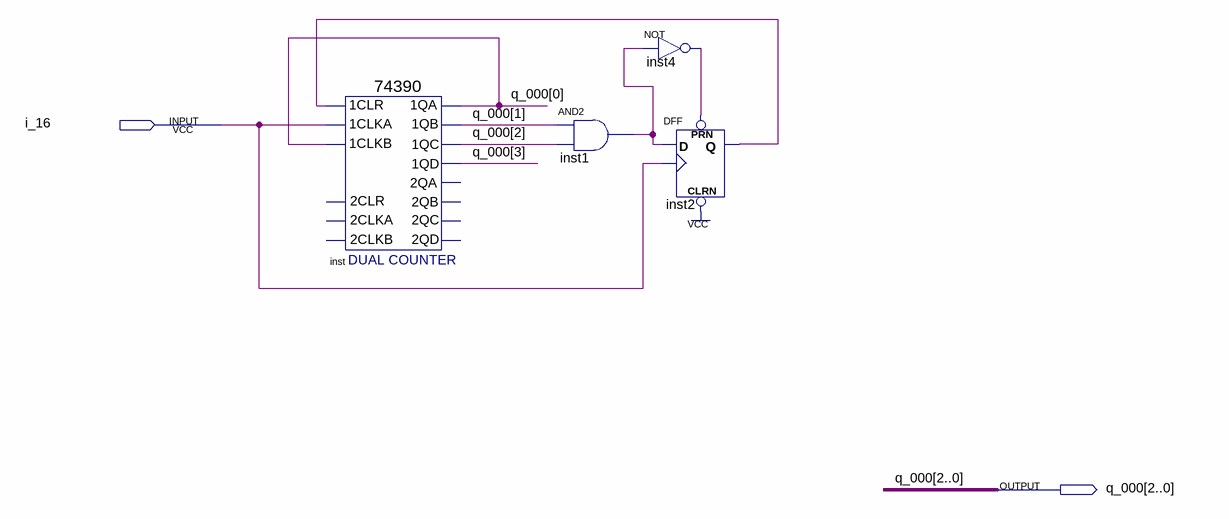
[diagram p0: schematic sheet]
// Quartus schematic cnt6.bdf as structural Verilog: 4 symbols, 2 pins
module cnt6 (
  input  i_16,
  output [3:0] q_000
);

  wire inst1_out, inst2_q, inst4_out;

  \74390  inst (
    .\1CLR (inst2_q), .\1CLKA (i_16), .\1CLKB (q_000[0]), .\1QA (q_000[0]), .\1QB (q_000[1]),
    .\1QC (q_000[2]), .\1QD (q_000[3]));  // open: 2CLKA, 2CLR, 2CLKB, 2QA, 2QB, 2QC, 2QD
  and inst1 (inst1_out, q_000[1], q_000[2]);
  not inst4 (inst4_out, inst1_out);
  DFF inst2 (.CLRN(1'b1), .CLK(i_16), .D(inst1_out), .PRN(inst4_out), .Q(inst2_q));
endmodule
